# EAGLE schematic arduino_DAC_autotest (EAGLE 9.6.2)
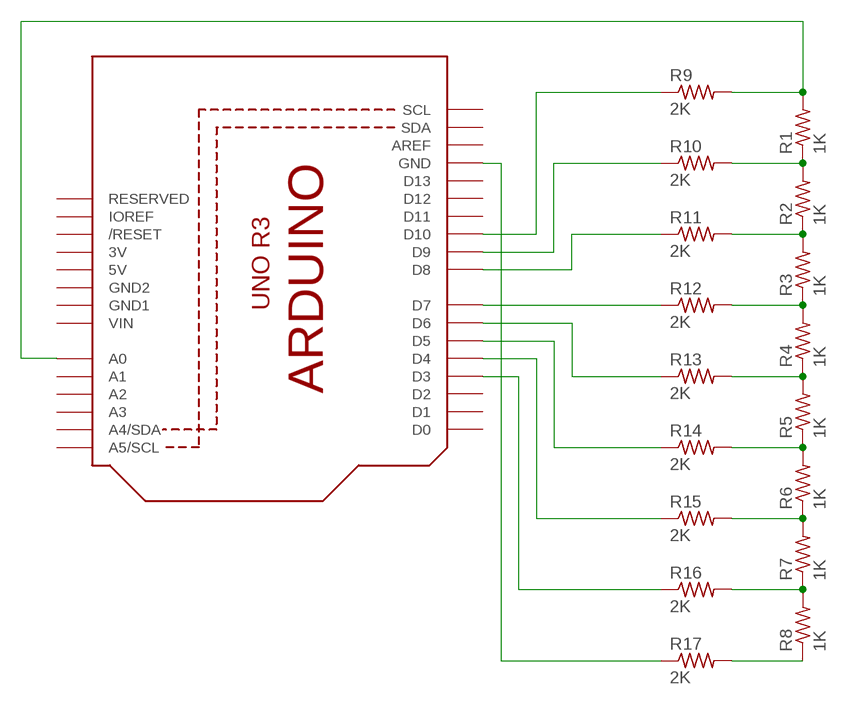
[diagram p0: schematic, sheet 1]

## Parts
R1  1K  R-US_0204/7  [0204/7]
R2  1K  R-US_0204/7  [0204/7]
R3  1K  R-US_0204/7  [0204/7]
R4  1K  R-US_0204/7  [0204/7]
R5  1K  R-US_0204/7  [0204/7]
R6  1K  R-US_0204/7  [0204/7]
R7  1K  R-US_0204/7  [0204/7]
R8  1K  R-US_0204/7  [0204/7]
R9  2K  R-US_0204/7  [0204/7]
R10  2K  R-US_0204/7  [0204/7]
R11  2K  R-US_0204/7  [0204/7]
R12  2K  R-US_0204/7  [0204/7]
R13  2K  R-US_0204/7  [0204/7]
R14  2K  R-US_0204/7  [0204/7]
R15  2K  R-US_0204/7  [0204/7]
R16  2K  R-US_0204/7  [0204/7]
R17  2K  R-US_0204/7  [0204/7]
U1  ARDUINOR3-DIMENSION  [ARDUINOR3]

## Nets
N$1: R1.1 R2.2 R10.2
N$2: R2.1 R3.2 R11.2
N$3: R3.1 R4.2 R12.2
N$4: R4.1 R5.2 R13.2
N$5: R5.1 R6.2 R14.2
N$6: R6.1 R7.2 R15.2
N$7: R1.2 R9.2 U1.A0
N$9: R7.1 R8.2 R16.2
N$10: R16.1 U1.D3
N$11: R15.1 U1.D4
N$12: R14.1 U1.D5
N$13: R13.1 U1.D6
N$14: R12.1 U1.D7
N$15: R11.1 U1.D8
N$16: R10.1 U1.D9
N$17: R9.1 U1.D10
N$19: R8.1 R17.2
N$20: R17.1 U1.GND
Unconnected: U1.A1 U1.A2 U1.A3 U1.A4(A4/SDA) U1.A5(A5/SCL) U1.AREF U1.D0 U1.D1 U1.D2 U1.D11 U1.D12 U1.D13 U1.IOREF U1.RESERVED U1.RESET(/RESET) U1.SCL U1.SDA

## Power pins joined to a net without a drawn wire
3V: U1.3V
5V: U1.5V
GND1: U1.GND1
GND2: U1.GND2
VIN: U1.VIN

## Library data of the parts
R1-R17 = adafruit:R-US_: RESISTOR, American symbol
U1 = adafruit:ARDUINOR3: This is a new object for the new Arduino R3 - with extra pins that you may want to use (such as IOref, and duplicated A4/A5

## Module TILT_SENSOR
Ports: 

### Library data of the parts